# Altium schematic sheet C_PITCHROLLER.schdoc
size 267 x 183 mm
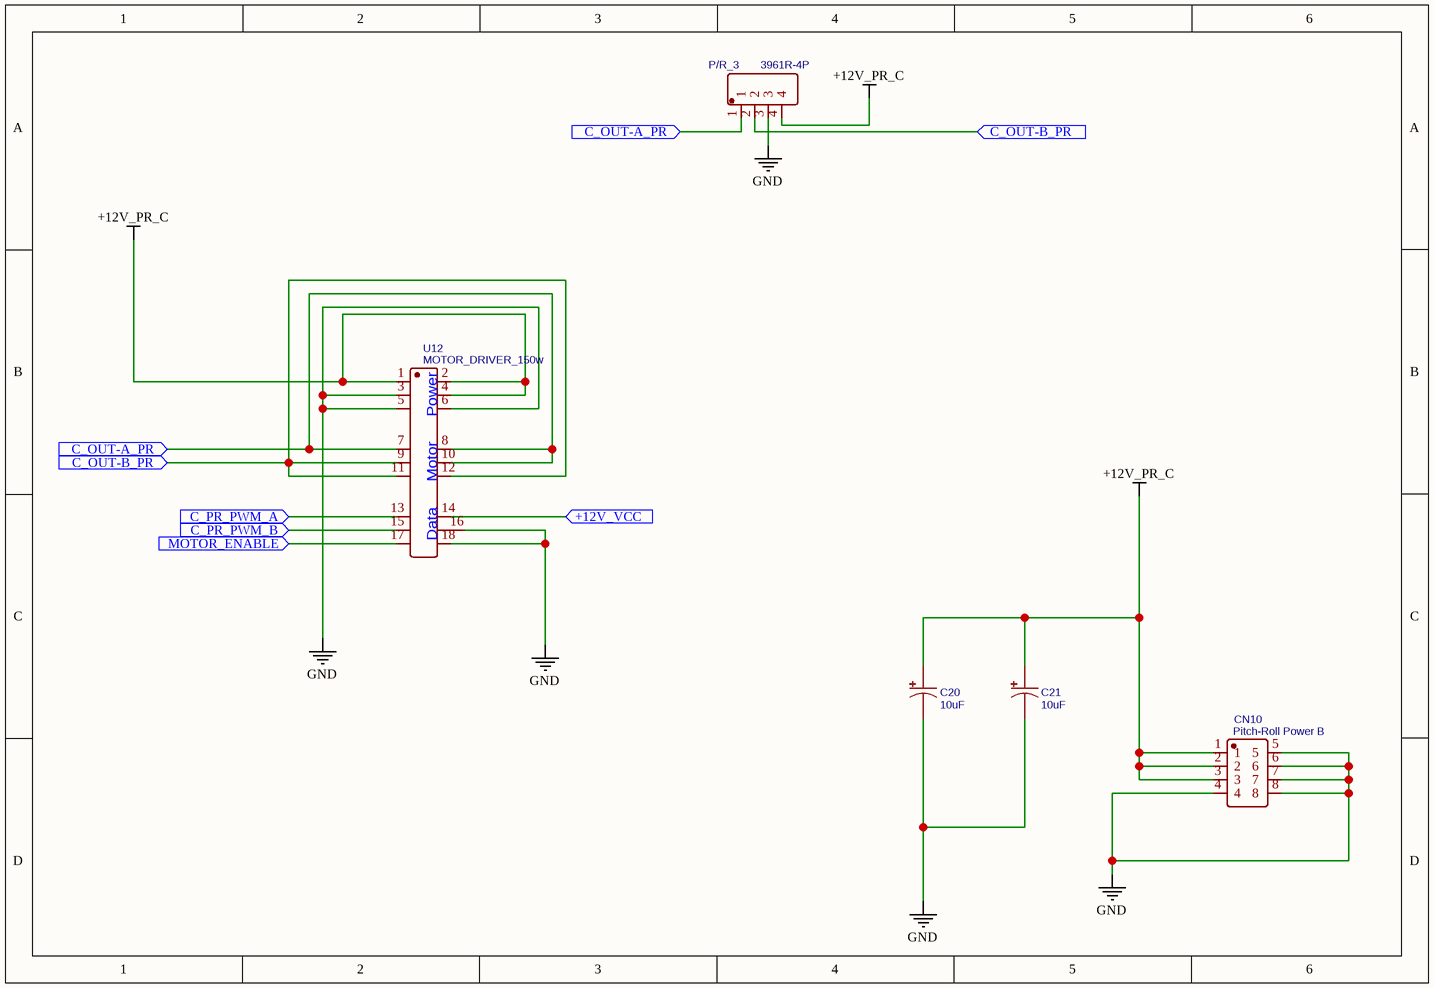
[diagram p0: C_PITCHROLLER.schdoc]

## Parts
C20  10uF  [CAP-SMD_BD4.0-L4.3-W4.3-FD]
C21  10uF  [CAP-SMD_BD4.0-L4.3-W4.3-FD]
CN10  Pitch-Roll Power B  [CONN-TH_8P-P4.20_X9357WV-2-04-N2SN]
P/R_3  3961R-4P  [CONN-TH_4P-P3.96_3961R-4P]
U12  MOTOR_DRIVER_150w  [MOTOR_DRIVE_150W_MODULE]

## Ports
+12V_VCC (in), C_OUT-A_PR (in), C_OUT-B_PR (in), C_PR_PWM_A (in), C_PR_PWM_B (in), MOTOR_ENABLE (in)

## Nets
+12V_PR_C: C20.1 C21.1 CN10.1 CN10.2 CN10.3 P/R_3.4 U12.1(+12V_YAW) U12.2(+12V_YAW) U12.4(+12V_YAW)
GND: C20.2 C21.2 CN10.4 CN10.5 CN10.6 CN10.7 CN10.8 P/R_3.3 U12.3(GND) U12.5(GND) U12.6(GND) U12.16(GND) U12.18(GND)
+12V_VCC: U12.14(+12V_VCC) ; port +12V_VCC
C_OUT-A_PR: P/R_3.1 U12.7(OUT-A_YAW) U12.8(OUT-A_YAW) U12.10(OUT-A_YAW) ; port C_OUT-A_PR
C_OUT-B_PR: P/R_3.2 U12.9(OUT-B_YAW) U12.11(OUT-B_YAW) U12.12(OUT-B_YAW) ; port C_OUT-B_PR
C_PR_PWM_A: U12.13(PWM-A_YAW) ; port C_PR_PWM_A
C_PR_PWM_B: U12.15(PWM-B_YAW) ; port C_PR_PWM_B
MOTOR_ENABLE: U12.17(MOTOR_ENABLE) ; port MOTOR_ENABLE

## Notes on the sheet
- (in symbol MOTOR_DRIVER_150w) Power; Motor; Data

## Library data of the parts
C20 C21 = 10uF: BOM_Manufacturer: ROQANG; BOM_Manufacturer Part: VT1E100M0405; nameAlias: Capacitance; Contributor: LCSC; BOM_Supplier: LCSC; BOM_Supplier Part: C213486; BOM_JLCPCB Part Class: Extended Part; JLCPCB Part Class: Extended Part; spicePre: C; spiceSymbolName: VT1E100M0405
CN10 = Pitch-Roll Power B: BOM_Manufacturer: XKB Enterprise; BOM_Manufacturer Part: X9357WV-2*04-N2SN; Contributor: LCSC; BOM_Supplier: LCSC; BOM_Supplier Part: C519240; BOM_JLCPCB Part Class: Extended Part; spicePre: C; spiceSymbolName: X9357WV-2*04-N2SN
P/R_3 = 3961R-4P: BOM_Manufacturer: Ckmtw; Contributor: LCSC; BOM_Supplier: LCSC; BOM_Manufacturer Part: 3961R-4P; BOM_Supplier Part: C138427; BOM_JLCPCB Part Class: Extended Part; spicePre: C; spiceSymbolName: 3961R-4P
U12 = MOTOR_DRIVER_150w: Contributor: digitalman; spicePre: U; spiceSymbolName: MOTOR_DRIVER_150w